# Altium project LimeSDR-PCIe_1v3.PrjPcb (part 5 of 7)

## Sheet 14_Clocks_1.SchDoc: Clocks 1
size A3; Organization: Lime Microsystems; Address1: Surrey Tech Centre; Address2: Guildford GU2 7YG; Address3: Surrey; Address4: United Kingdom; Revision: v1.3; SheetNumber: 14; SheetTotal: 16
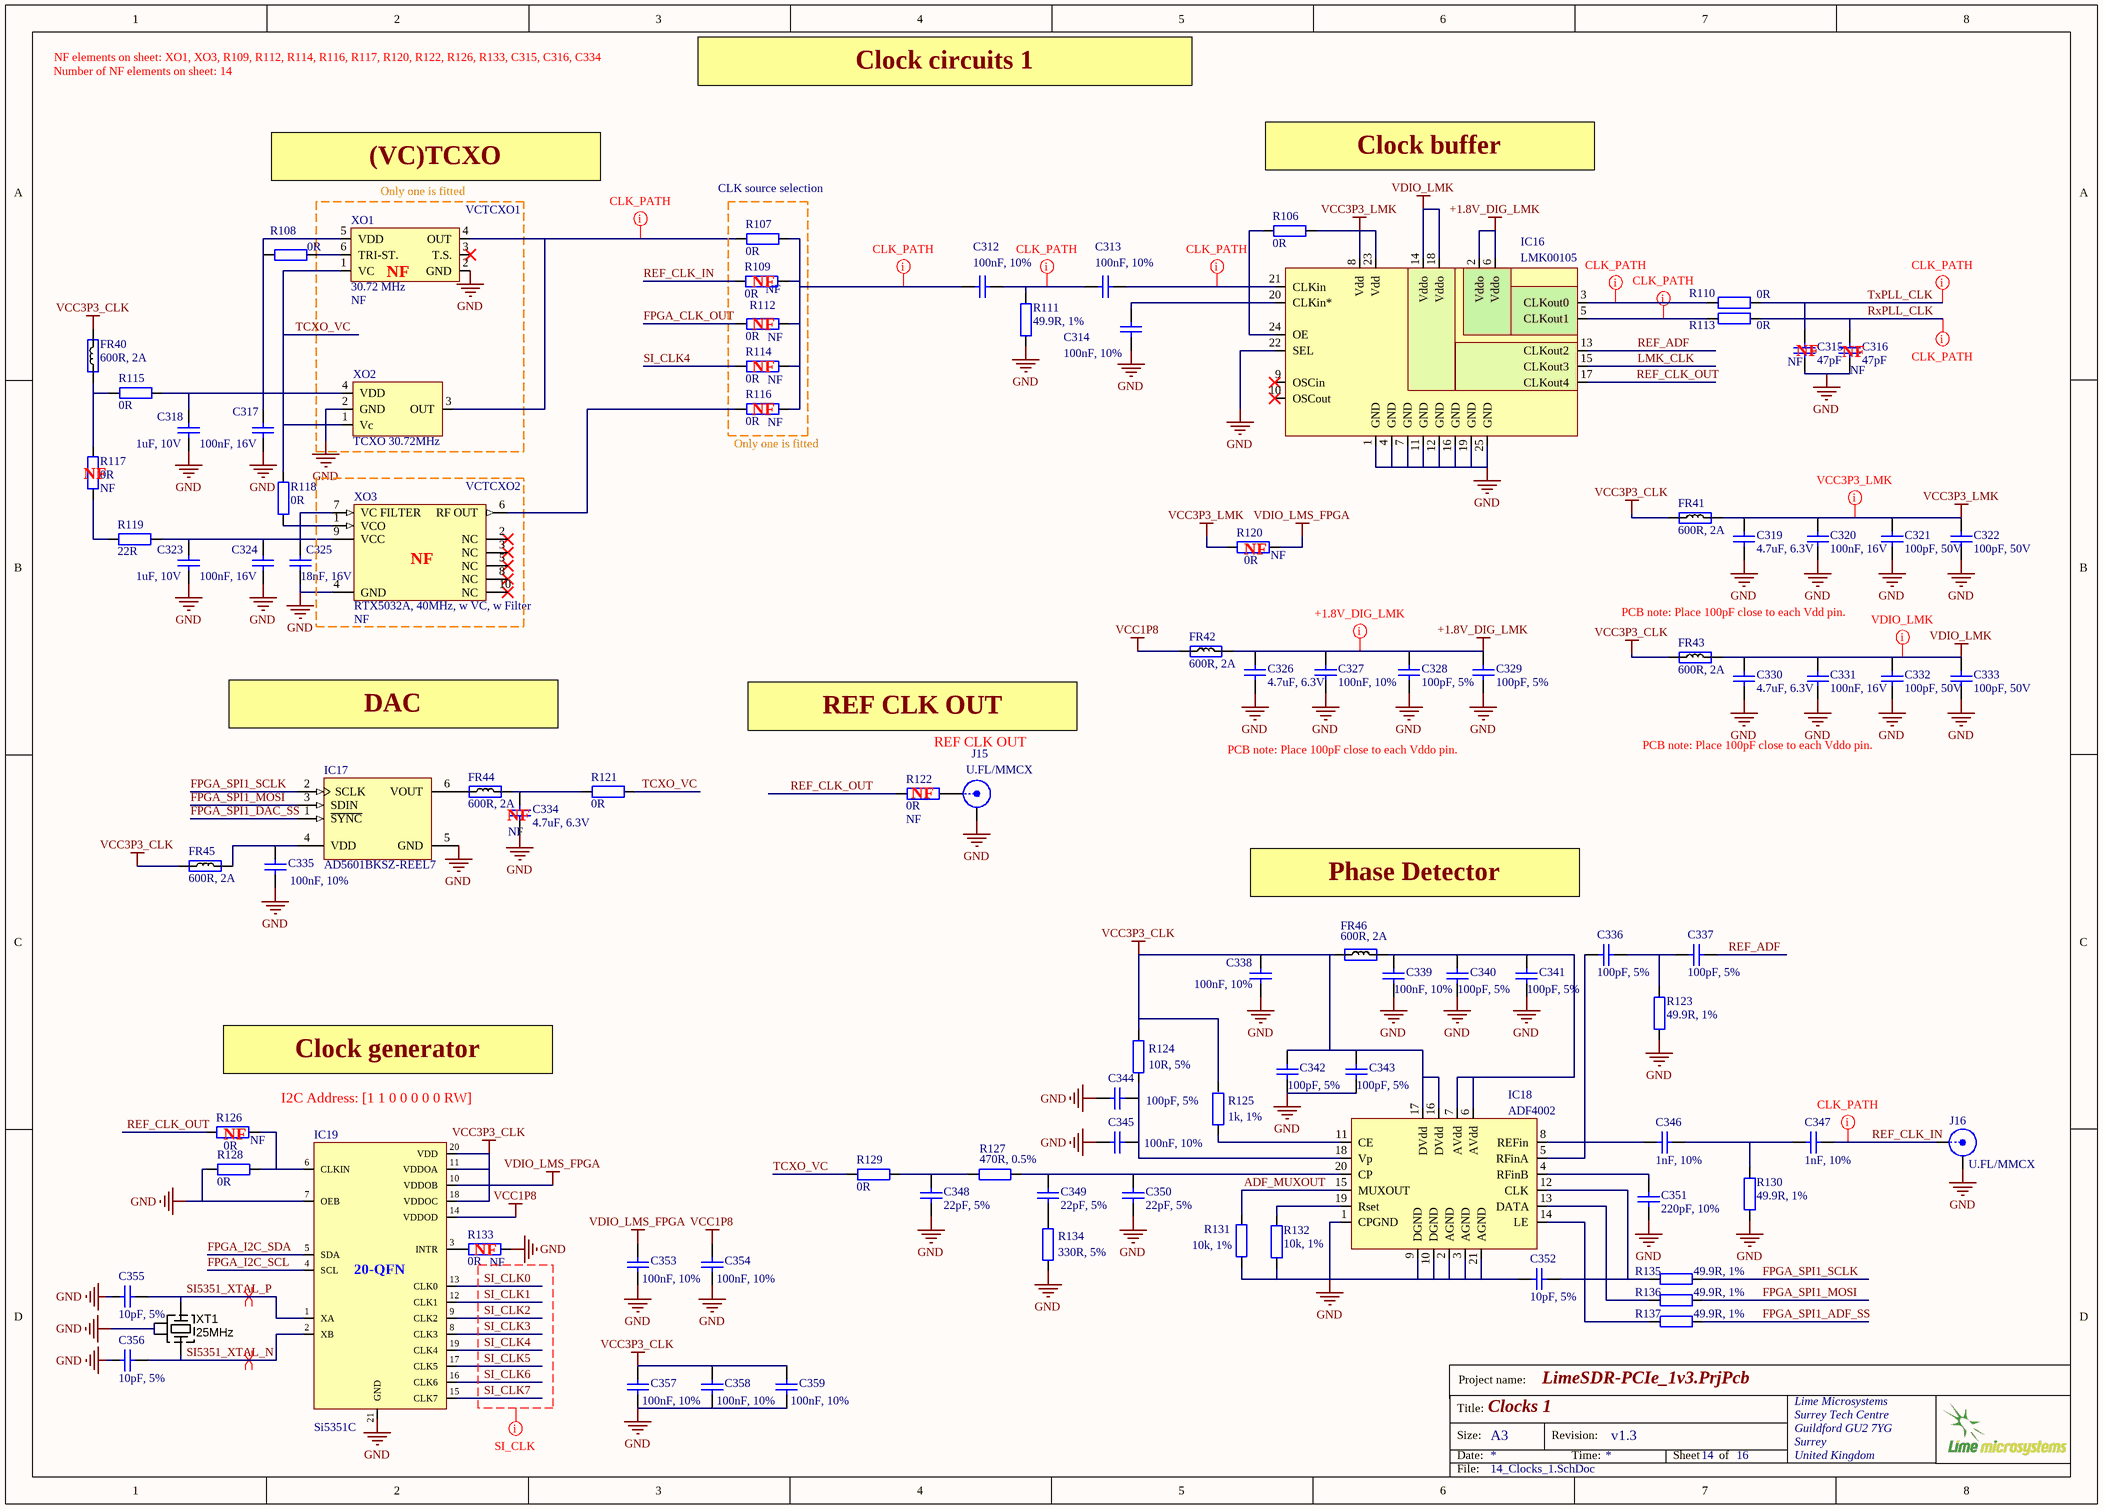
[diagram p14: 14_Clocks_1.SchDoc]

### Parts
C312  100nF, 10%  [CAP0402]
C313  100nF, 10%  [CAP0402]
C314  100nF, 10%  [CAP0402]
C315  47pF  Assembly Info: NF  [CAP0402]
C316  47pF  Assembly Info: NF  [CAP0402]
C317  100nF, 16V  [CAP0402]
C318  1uF, 10V  [CAP0402]
C319  4.7uF, 6.3V  [CAP0402]
C320  100nF, 16V  [CAP0402]
C321  100pF, 50V  [CAP0402]
C322  100pF, 50V  [CAP0402]
C323  1uF, 10V  [CAP0402]
C324  100nF, 16V  [CAP0402]
C325  18nF, 16V  [CAP0402]
C326  4.7uF, 6.3V  [CAP0402]
C327  100nF, 10%  [CAP0402]
C328  100pF, 5%  [CAP0402]
C329  100pF, 5%  [CAP0402]
C330  4.7uF, 6.3V  [CAP0402]
C331  100nF, 16V  [CAP0402]
C332  100pF, 50V  [CAP0402]
C333  100pF, 50V  [CAP0402]
C334  4.7uF, 6.3V  Assembly Info: NF  [CAP0402]
C335  100nF, 10%  [CAP0402]
C336  100pF, 5%  [CAP0402]
C337  100pF, 5%  [CAP0402]
C338  100nF, 10%  [CAP0402]
C339  100nF, 10%  [CAP0402]
C340  100pF, 5%  [CAP0402]
C341  100pF, 5%  [CAP0402]
C342  100pF, 5%  [CAP0402]
C343  100pF, 5%  [CAP0402]
C344  100pF, 5%  [CAP0402]
C345  100nF, 10%  [CAP0402]
C346  1nF, 10%  [CAP0402]
C347  1nF, 10%  [CAP0402]
C348  22pF, 5%  [CAP0402]
C349  22pF, 5%  [CAP0402]
C350  22pF, 5%  [CAP0402]
C351  220pF, 10%  [CAP0402]
C352  10pF, 5%  [CAP0402]
C353  100nF, 10%  [CAP0402]
C354  100nF, 10%  [CAP0402]
C355  10pF, 5%  [CAP0402]
C356  10pF, 5%  [CAP0402]
C357  100nF, 10%  [CAP0402]
C358  100nF, 10%  [CAP0402]
C359  100nF, 10%  [CAP0402]
FR40  600R, 2A  [RES0805]
FR41  600R, 2A  [RES0805]
FR42  600R, 2A  [RES0805]
FR43  600R, 2A  [RES0805]
FR44  600R, 2A  [RES0805]
FR45  600R, 2A  [RES0805]
FR46  600R, 2A  [RES0805]
IC16  LMK00105  [LMK00105SQ]
IC17  AD5601BKSZ-REEL7  [AD5601_SOT23-6]
IC18  ADF4002  [ADF4002]
IC19  Si5351C  [Si5351C_20QFN]
J15  U.FL/MMCX  [MMCX_UFL_conn_u]
J16  U.FL/MMCX  [MMCX_UFL_conn_u]
R106  0R  [RES0402]
R107  0R  [RES0402_v2]
R108  0R  [RES0402]
R109  0R  Assembly Info: NF  [RES0402_v2]
R110  0R  [RES0402]
R111  49.9R, 1%  [RES0402]
R112  0R  Assembly Info: NF  [RES0402_v2]
R113  0R  [RES0402]
R114  0R  Assembly Info: NF  [RES0402_v2]
R115  0R  [RES0402]
R116  0R  Assembly Info: NF  [RES0402_v2]
R117  0R  Assembly Info: NF  [RES0402]
R118  0R  [RES0402]
R119  22R  [RES0402]
R120  0R  Assembly Info: NF  [RES0402]
R121  0R  [RES0402]
R122  0R  Assembly Info: NF  [RES0402]
R123  49.9R, 1%  [RES0402]
R124  10R, 5%  [RES0402]
R125  1k, 1%  [RES0402]
R126  0R  Assembly Info: NF  [RES0402]
R127  470R, 0.5%  [RES0402]
R128  0R  [RES0402]
R129  0R  [RES0402]
R130  49.9R, 1%  [RES0402]
R131  10k, 1%  [RES0402]
R132  10k, 1%  [RES0402]
R133  0R  Assembly Info: NF  [RES0402]
R134  330R, 5%  [RES0402]
R135  49.9R, 1%  [RES0402]
R136  49.9R, 1%  [RES0402]
R137  49.9R, 1%  [RES0402]
XO1  30.72 MHz  Assembly Info: NF  [RAKON_RPT7050A]
XO2  TCXO 30.72MHz  [RAKON_TXCO]
XO3  RTX5032A, 40MHz, w VC, w Filter  Assembly Info: NF  [RAKON_RTX5032A]
XT1  25MHz  [CRYSTAL_4-LCC]

### Blocks framed on the sheet
VCTCXO2: XO3

### Nets
+1.8V_DIG_LMK: C326.2 C327.2 C328.2 C329.2 FR42.2 IC16.2(Vddo) IC16.6(Vddo)
GND: C314.1 C315.1 C316.1 C317.1 C318.1 C319.1 C320.1 C321.1 C322.1 C323.1 C324.1 C325.1 C326.1 C327.1 C328.1 C329.1 C330.1 C331.1 C332.1 C333.1 C334.1 C335.2 C338.1 C339.1 C340.2 C341.2 C342.2 C343.2 C344.1 C345.2 C348.1 C350.1 C351.2 C352.1 C353.2 C354.2 C355.1 C356.1 C357.2 C358.2 C359.2 IC16.1(GND) IC16.4(GND) IC16.7(GND) IC16.11(GND) IC16.12(GND) IC16.16(GND) IC16.19(GND) IC16.22(SEL) IC16.25(GND) IC17.5(GND) IC18.1(CPGND) IC18.2(AGND) IC18.3(AGND) IC18.9(DGND) IC18.10(DGND) IC18.21(AGND) IC19.7(OEB) IC19.21(GND) J15.2(Y) J16.2(Y) R111.1 R123.1 R128.2 R130.1 R131.2 R132.2 R133.1 R134.1 XO1.2(GND) XO2.2(GND) XO3.4(GND) XT1.2(GND) XT1.4(GND)
VCC1P8: C354.1 FR42.1 IC19.14(VDDOD)
VCC3P3_CLK: C338.2 C342.1 C343.1 C357.1 C358.1 C359.1 FR40.1 FR41.1 FR43.1 FR45.1 FR46.1 IC18.16(DVdd) IC18.17(DVdd) IC19.11(VDDOA) IC19.18(VDDOC) IC19.20(VDD) R124.2 R125.2
VCC3P3_LMK: C319.2 C320.2 C321.2 C322.2 FR41.2 IC16.8(Vdd) IC16.23(Vdd) R106.2 R120.1
VDIO_LMK: C330.2 C331.2 C332.2 C333.2 FR43.2 IC16.14(Vddo) IC16.18(Vddo)
VDIO_LMS_FPGA: C353.1 IC19.10(VDDOB) R120.2
ADF_MUXOUT: IC18.15(MUXOUT) R131.1
FPGA_CLK_OUT: R112.2
FPGA_I2C_SCL: IC19.4(SCL)
FPGA_I2C_SDA: IC19.5(SDA)
FPGA_SPI1_ADF_SS: R137.1
FPGA_SPI1_DAC_SS: IC17.1(~{SYNC})
FPGA_SPI1_MOSI: IC17.3(SDIN) R136.1
FPGA_SPI1_SCLK: IC17.2(SCLK) R135.1
LMK_CLK: IC16.15(CLKout3)
REF_ADF: C337.2 IC16.13(CLKout2)
REF_CLK_IN: C347.1 J16.1(X) R109.1
REF_CLK_OUT: IC16.17(CLKout4) R122.2 R126.1
RxPLL_CLK: C316.2 R113.1
SI5351_XTAL_N: C356.2 IC19.2(XB) XT1.3(X)
SI5351_XTAL_P: C355.2 IC19.1(XA) XT1.1(X)
SI_CLK0: IC19.13(CLK0)
SI_CLK1: IC19.12(CLK1)
SI_CLK2: IC19.9(CLK2)
SI_CLK3: IC19.8(CLK3)
SI_CLK4: IC19.19(CLK4) R114.2
SI_CLK5: IC19.17(CLK5)
SI_CLK6: IC19.16(CLK6)
SI_CLK7: IC19.15(CLK7)
TCXO_VC: R118.1 R121.1 R129.2 XO1.1(VC) XO2.1(Vc)
TxPLL_CLK: C315.2 R110.1
NetC312_1: C312.1 C313.2 R111.2
NetC312_2: C312.2 R107.1 R109.2 R112.1 R114.1 R116.1
NetC313_1: C313.1 IC16.21(CLKin)
NetC314_2: C314.2 IC16.20(CLKin*)
NetC317_2: C317.2 C318.2 R108.2 R115.1 XO1.5(VDD) XO2.4(VDD)
NetC323_2: C323.2 C324.2 R119.2 XO3.9(VCC)
NetC325_2: C325.2 XO3.7(VC_FILTER)
NetC334_2: C334.2 FR44.2 R121.2
NetC335_1: C335.1 FR45.2 IC17.4(VDD)
NetC336_1: C336.1 IC18.5(RFinA)
NetC336_2: C336.2 C337.1 R123.2
NetC339_2: C339.2 C340.1 C341.1 FR46.2 IC18.6(AVdd) IC18.7(AVdd)
NetC344_2: C344.2 C345.1 IC18.18(Vp) R124.1
NetC346_1: C346.1 C347.2 R130.2
NetC346_2: C346.2 IC18.8(REFin)
NetC348_2: C348.2 R127.2 R129.1
NetC349_1: C349.1 R134.2
NetC349_2: C349.2 C350.2 IC18.20(CP) R127.1
NetC351_1: C351.1 IC18.4(RFinB)
NetC352_2: C352.2 IC18.12(CLK) R135.2
NetFR40_2: FR40.2 R115.2 R117.1
NetFR44_1: FR44.1 IC17.6(VOUT)
NetIC16_3: IC16.3(CLKout0) R110.2
NetIC16_5: IC16.5(CLKout1) R113.2
NetIC16_24: IC16.24(OE) R106.1
NetIC18_11: IC18.11(CE) R125.1
NetIC18_13: IC18.13(DATA) R136.2
NetIC18_14: IC18.14(LE) R137.2
NetIC18_19: IC18.19(Rset) R132.1
NetIC19_3: IC19.3(INTR) R133.2
NetIC19_6: IC19.6(CLKIN) R126.2 R128.1
NetJ15_1: J15.1(X) R122.1
NetR107_2: R107.2 XO1.4(OUT) XO2.3(OUT)
NetR108_1: R108.1 XO1.6(TRI-ST.)
NetR116_2: R116.2 XO3.6(RF_OUT)
NetR117_2: R117.2 R119.1
NetR118_2: R118.2 XO3.1(VCO)

Not connected (* = marked no-connect by the designer): IC16 9(OSCin)* 10(OSCout)*; XO1 3(T.S.)*; XO3 2(NC)* 3(NC)* 5(NC)* 8(NC)* 10(NC)*

### Layout directives
net class CLK_PATH: NetC312_1, NetC312_2, NetC313_1, NetIC16_3, NetIC16_5, NetR107_2, REF_CLK_IN, RxPLL_CLK, TxPLL_CLK
net class SI_CLK: SI_CLK0, SI_CLK1, SI_CLK2, SI_CLK3, SI_CLK4, SI_CLK5, SI_CLK6, SI_CLK7
differential pair: SI5351_XTAL_N, SI5351_XTAL_P
net class +1.8V_DIG_LMK: +1.8V_DIG_LMK
net class VCC3P3_LMK: VCC3P3_LMK
net class VDIO_LMK: VDIO_LMK

### Notes on the sheet
- Number of NF elements on sheet: 14
- NF elements on sheet: XO1, XO3, R109, R112, R114, R116, R117, R120, R122, R126, R133, C315, C316, C334
- Clock circuits 1
- (VC)TCXO
- Clock buffer
- (near XO1) Only one is fitted
- (near XO1) VCTCXO1
- (near R107) CLK source selection
- (near XO1) NF
- (near R109) NF
- (near R112) NF
- (near R114) NF
- (near C315) NF
- (near C316) NF
- (near R116) Only one is fitted
- (near R116) NF
- (near R117) NF
- (near XO3) NF
- (near R120) NF
- PCB note: Place 100pF close to each Vdd pin.
- DAC
- REF CLK OUT
- PCB note: Place 100pF close to each Vddo pin.
- (near C334) NF
- (near R122) NF
- Phase Detector
- Clock generator
- I2C Address: [1 1 0 0 0 0 0 RW]
- (near R126) NF
- (near R133) NF
- Project name:
- Title:
- Size:
- Date:
- A3
- Revision:
- Time:
- Sheet
- of
- File:
- (in symbol Si5351C) 20-QFN

### Library data of the parts
C312-C314 C327 C338 C339 C345 = Cap_0402: Manufacturer: Murata Electronics; Manufacturer Part Number: GRM155R71C104KA88D; Part Description: 0.10µF ±10% 16V X7R Ceramic Capacitor -55°C ~ 125°C Surface Mount, MLCC 0402 (1005 Metric) 0.039" L x 0.020" W (1.00mm x 0.50mm); Voltage Rating DC: 16 V; Type: General Purpose MLCC; Capacitance: 0.1 uF; Case Length: 1 mm; Dielectric: X7R; Case Height: 0.5 mm; Temperature Coefficient / Code: +/- 15 %; Value: 100nF, 10%; Supplier 1: Mouser; Supplier Part Number 1: 81-GRM155R71C104KA88; Case Code - in: 0402; RoHS: RoHS Compliant; Operating Temperature Range: - 55 C to + 125 C; Series: GRM; Termination Style: SMD/SMT; Tolerance: 10 %; Package / Case: 0402 (1005 metric); Maximum Operating Temperature: + 125 C; Case Code - mm: 1005; Minimum Operating Temperature: - 55 C; Product Category: Low & Medium Capacitance SMD Ceramic Chip Capacitors; Packaging: Reel; Product: General Type MLCCs; Category: Multilayer Ceramic Capacitors MLCC - SMD/SMT; Brand: Murata Electronics; Case Width: 0.5 mm; RoHS - Mouser: Y; Standard Pack Qty: 10000; Minimum Order Quantity: 1; Reeling: True; Manufacturer Part Number 1: GRM155R71C104KA88D
C315 C316 = Cap_0402: Manufacturer Part Number 1: C1005C0G1H470F050BA; Manufacturer: TDK Corporation; Part Description: 47pF ±1% 50V C0G, NP0 Ceramic Capacitor -55°C ~ 125°C Surface Mount, MLCC 0402 (1005 Metric) 0.039" L x 0.020" W (1.00mm x 0.50mm); Voltage - Rated: 50V; Temperature Coefficient: C0G, NP0; Tolerance: ±1%; Value: 47pF; Supplier 1: Digi-Key; Supplier Part Number 1: 445-5361-1-ND; Package / Case: 0402 (1005 Metric); Lead Spacing: -; Ratings: -; Mounting Type: Surface Mount, MLCC; Operating Temperature: -55°C ~ 125°C; Thickness (Max): 0.022" (0.55mm); Capacitance: 47pF; Packaging: Cut Tape (CT); Features: -; Applications: General Purpose; Lead Style: -; Size / Dimension: 0.039" L x 0.020" W (1.00mm x 0.50mm); Height - Seated (Max): -; RoHS: RoHS Compliant; Category: Capacitors
C317 C320 C324 C331 = Cap_0402: Manufacturer: Murata Electronics; Manufacturer Part Number: GRM155R71C104KA88D; Part Description: 0.10µF ±10% 16V X7R Ceramic Capacitor -55°C ~ 125°C Surface Mount, MLCC 0402 (1005 Metric) 0.039" L x 0.020" W (1.00mm x 0.50mm); Tolerance: 10 %; Type: General Purpose MLCC; Capacitance: 0.1 uF; Case Length: 1 mm; Dielectric: X7R; Case Height: 0.5 mm; Temperature Coefficient / Code: +/- 15 %; Value: 100nF, 16V; Supplier 1: Mouser; Supplier Part Number 1: 81-GRM155R71C104KA88; Case Code - in: 0402; RoHS: RoHS Compliant; Operating Temperature Range: - 55 C to + 125 C; Series: GRM; Termination Style: SMD/SMT; Package / Case: 0402 (1005 metric); Voltage Rating DC: 16 V; Maximum Operating Temperature: + 125 C; Case Code - mm: 1005; Minimum Operating Temperature: - 55 C; Product Category: Low & Medium Capacitance SMD Ceramic Chip Capacitors; Packaging: Reel; Product: General Type MLCCs; Category: Multilayer Ceramic Capacitors MLCC - SMD/SMT; Brand: Murata Electronics; Case Width: 0.5 mm; RoHS - Mouser: Y; Standard Pack Qty: 10000; Minimum Order Quantity: 1; Reeling: True; Manufacturer Part Number 1: GRM155R71C104KA88D
C318 C323 = Cap_0402: Manufacturer Part Number 1: GRM155R61A105KE15J; Manufacturer: TDK; Part Description: 1µF ±10% 10V X5R Ceramic Capacitor -55°C ~ 85°C Surface Mount, MLCC 0402 (1005 Metric) 0.039" L x 0.020" W (1.00mm x 0.50mm); Voltage Rating: 10; Capacitance Tolerance: ± 10%; Product Range: TDK - C Series; Ceramic Capacitor Case: 0402 [1005 Metric]; Capacitance: 1; Dielectric Characteristic: X6; Value: 1uF, 10V; Supplier 1: Newark; Supplier Part Number 1: 490-6298-2-ND; MSL: -; RoHS: YES
C319 C326 C330 C334 = Cap_0402: Manufacturer Part Number 1: GRM155R60J475ME87D; Manufacturer: Murata Electronics North America; Part Description: 4.7µF ±20% 6.3V X5R Ceramic Capacitor -55°C ~ 85°C Surface Mount, MLCC 0402 (1005 Metric) 0.039" L x 0.020" W (1.00mm x 0.50mm); Temperature Coefficient: X5R; Capacitance: 4.7µF; Tolerance: ±20%; Value: 4.7uF, 6.3V; Supplier 1: Digi-Key; Supplier Part Number 1: 490-5408-1-ND; Category: Capacitors; Voltage - Rated: 6.3V; Thickness (Max): 0.022" (0.55mm); Applications: General Purpose; Package / Case: 0402 (1005 Metric); Size / Dimension: 0.039" L x 0.020" W (1.00mm x 0.50mm); Features: Derating Recommended; Mounting Type: Surface Mount, MLCC; Ratings: -; Lead Style: -; Operating Temperature: -55°C ~ 85°C; Lead Spacing: -; RoHS: RoHS Compliant; Height - Seated (Max): -; Packaging: Cut Tape (CT)
C321 C322 C332 C333 = Cap_0402: Manufacturer Part Number 1: CC0402JRNPO9BN101; Manufacturer: Yageo; Part Description: 100pF ±5% 50V C0G, NP0 Ceramic Capacitor -55°C ~ 125°C Surface Mount, MLCC 0402 (1005 Metric) 0.039" L x 0.020" W (1.00mm x 0.50mm); Temperature Coefficient: C0G, NP0; Tolerance: ±5%; Value: 100pF, 50V; Supplier 1: Digi-Key; Supplier Part Number 1: 311-1024-1-ND; RoHS: RoHS Compliant; Category: Capacitors; Applications: General Purpose; Mounting Type: Surface Mount, MLCC; Capacitance: 100pF; Ratings: -; Packaging: Cut Tape (CT); Voltage - Rated: 50V; Size / Dimension: 0.039" L x 0.020" W (1.00mm x 0.50mm); Height - Seated (Max): -; Package / Case: 0402 (1005 Metric); Operating Temperature: -55°C ~ 125°C; Features: -; Lead Spacing: -; Lead Style: -; Thickness (Max): 0.022" (0.55mm)
C325 = Cap_0402: Manufacturer: Yageo; Manufacturer Part Number 1: CC0402KRX7R7BB183; Part Description: CAP CER 0.018UF 16V X7R 0402; Temperature Coefficient: X7R; Capacitance: 0.018µF; Tolerance: ±10%; Value: 18nF, 16V; Supplier 1: Digi-Key; Supplier Part Number 1: 311-1706-1-ND; Part Status: Active; Category: Capacitors; Packaging: Cut Tape (CT); Voltage - Rated: 16V; RoHS: RoHS Compliant; Size / Dimension: 0.039" L x 0.020" W (1.00mm x 0.50mm); Package / Case: 0402 (1005 Metric); Mounting Type: Surface Mount, MLCC; Thickness (Max): 0.022" (0.55mm); Applications: General Purpose; Operating Temperature: -55°C ~ 125°C
C328 C329 = Cap_0402: Manufacturer Part Number 1: CC0402JRNPO9BN101; Manufacturer: Yageo; Part Description: 100pF ±5% 50V C0G, NP0 Ceramic Capacitor -55°C ~ 125°C Surface Mount, MLCC 0402 (1005 Metric) 0.039" L x 0.020" W (1.00mm x 0.50mm); Voltage - Rated: 50V; Temperature Coefficient: C0G, NP0; Value: 100pF, 5%; Supplier 1: Digi-Key; Supplier Part Number 1: 311-1024-1-ND; RoHS: RoHS Compliant; Category: Capacitors; Applications: General Purpose; Mounting Type: Surface Mount, MLCC; Capacitance: 100pF; Ratings: -; Packaging: Cut Tape (CT); Size / Dimension: 0.039" L x 0.020" W (1.00mm x 0.50mm); Height - Seated (Max): -; Package / Case: 0402 (1005 Metric); Operating Temperature: -55°C ~ 125°C; Features: -; Tolerance: ±5%; Lead Spacing: -; Lead Style: -; Thickness (Max): 0.022" (0.55mm)
C335 C353 C354 C357-C359 = Cap_0603: Manufacturer Part Number 1: GRM155R71C104KA88D; Part Description: 0.10µF ±10% 16V X7R Ceramic Capacitor -55°C ~ 125°C Surface Mount, MLCC 0402 (1005 Metric) 0.039" L x 0.020" W (1.00mm x 0.50mm); Brand: Murata Electronics; Type: General Purpose MLCC; Capacitance: 0.1 uF; Temperature Coefficient / Code: +/- 15 %; Voltage Rating DC: 16 V; Supplier 1: Mouser; Supplier Part Number 1: 81-GRM155R71C104KA88; Tolerance: 10 %; Case Code - in: 0402; Manufacturer: Murata Electronics; Category: Multilayer Ceramic Capacitors MLCC - SMD/SMT; Value: 100nF, 10%; Manufacturer Part Number: GRM155R71C104KA88D; Maximum Operating Temperature: + 125 C; Minimum Operating Temperature: - 55 C; Minimum Order Quantity: 1; Operating Temperature Range: - 55 C to + 125 C; Package / Case: 0402 (1005 metric); Packaging: Reel; Product: General Type MLCCs; Product Category: Low & Medium Capacitance SMD Ceramic Chip Capacitors; Reeling: True; RoHS - Mouser: Y; RoHS: RoHS Compliant; Series: GRM; Standard Pack Qty: 10000; Termination Style: SMD/SMT
C336 C337 C340-C344 = Cap_0402: Manufacturer: Yageo; Manufacturer Part Number 1: CC0402JRNPO9BN101; Part Description: 100pF ±5% 50V C0G, NP0 Ceramic Capacitor -55°C ~ 125°C Surface Mount, MLCC 0402 (1005 Metric) 0.039" L x 0.020" W (1.00mm x 0.50mm); Voltage - Rated: 50V; Temperature Coefficient: C0G, NP0; Value: 100pF, 5%; Supplier 1: Digi-Key; Supplier Part Number 1: 311-1024-1-ND; Category: Capacitors; Features: -; Operating Temperature: -55°C ~ 125°C; Capacitance: 100pF; Thickness (Max): 0.022" (0.55mm); RoHS: RoHS Compliant; Lead Style: -; Ratings: -; Size / Dimension: 0.039" L x 0.020" W (1.00mm x 0.50mm); Height - Seated (Max): -; Applications: General Purpose; Package / Case: 0402 (1005 Metric); Lead Spacing: -; Packaging: Tape & Reel (TR); Mounting Type: Surface Mount, MLCC; Tolerance: ±5%
C346 C347 = Cap_0402: Manufacturer Part Number 1: GCM155R71H102KA37D; Part Description: 1000pF ±10% 50V X7R Ceramic Capacitor -55°C ~ 125°C Surface Mount, MLCC 0402 (1005 Metric) 0.039" L x 0.020" W (1.00mm x 0.50mm); Capacitance: 1000 pF; Type: Automotive Ultra Small MLCC; Brand: Murata Electronics; Case Height: 0.5 mm; Case Length: 1 mm; Dielectric: X7R; Voltage Rating DC: 50 V; Temperature Coefficient / Code: +/- 15 %; Value: 1nF, 10%; Supplier 1: Mouser; Supplier Part Number 1: 81-GCM155R71H102KA7D; Case Code - in: 0402; Package / Case: 0402 (1005 metric); Tolerance: 10 %; Termination Style: SMD/SMT; Packaging: Reel; Operating Temperature Range: - 55 C to + 125 C; Maximum Operating Temperature: + 125 C; Manufacturer: Murata Electronics; Category: Multilayer Ceramic Capacitors MLCC - SMD/SMT; RoHS: RoHS Compliant; Series: GCM; Case Width: 0.5 mm; Case Code - mm: 1005; Product: Automotive MLCCs; Standard Pack Qty: 10000; Reeling: True; RoHS - Mouser: Y; Minimum Order Quantity: 1; Product Category: Automotive Ceramic Chip Capacitors; Minimum Operating Temperature: - 55 C
C348-C350 = Cap_0402: Manufacturer: Yageo; Manufacturer Part Number 1: CC0402JRNPO9BN220; Part Description: 22pF ±5% 50V C0G, NP0 Ceramic Capacitor -55°C ~ 125°C Surface Mount, MLCC 0402 (1005 Metric) 0.039" L x 0.020" W (1.00mm x 0.50mm); Voltage - Rated: 50V; Temperature Coefficient: C0G, NP0; Value: 22pF, 5%; Supplier 1: Digi-Key; Supplier Part Number 1: 311-1018-2-ND; Tolerance: ±5%; Category: Capacitors; Packaging: Tape & Reel (TR); RoHS: RoHS Compliant; Capacitance: 22pF; Operating Temperature: -55°C ~ 125°C; Mounting Type: Surface Mount, MLCC; Height - Seated (Max): -; Size / Dimension: 0.039" L x 0.020" W (1.00mm x 0.50mm); Ratings: -; Applications: General Purpose; Thickness (Max): 0.022" (0.55mm); Lead Spacing: -; Lead Style: -; Features: -; Package / Case: 0402 (1005 Metric)
C351 = Cap_0402: Manufacturer Part Number 1: CC0402KRX7R9BB221; Manufacturer: Yageo; Part Description: 220pF ±10% 50V X7R Ceramic Capacitor -55°C ~ 125°C Surface Mount, MLCC 0402 (1005 Metric) 0.039" L x 0.020" W (1.00mm x 0.50mm); Temperature Coefficient: X7R; Voltage - Rated: 50V; Value: 220pF, 10%; Supplier 1: Digi-Key; Supplier Part Number 1: 311-1035-2-ND; Category: Capacitors; Ratings: -; RoHS: RoHS Compliant; Packaging: Tape & Reel (TR); Mounting Type: Surface Mount, MLCC; Applications: General Purpose; Capacitance: 220pF; Tolerance: ±10%; Operating Temperature: -55°C ~ 125°C; Package / Case: 0402 (1005 Metric); Lead Spacing: -; Size / Dimension: 0.039" L x 0.020" W (1.00mm x 0.50mm); Thickness (Max): 0.022" (0.55mm); Height - Seated (Max): -; Lead Style: -; Features: -
C352 = Cap_0402: Manufacturer Part Number 1: 04023A100JAT2A; Manufacturer: AVX; Part Description: 10pF ±5% 25V C0G, NP0 Ceramic Capacitor -55°C ~ 125°C Surface Mount, MLCC 0402 (1005 Metric) 0.039" L x 0.020" W (1.00mm x 0.50mm); Voltage Rating: 25; Ceramic Capacitor Case: 0402 [1005 Metric]; Capacitor Case Style: 0402 [1005 Metric]<!--FANDB--><div class="features-and-benefits-container"></div>; Dielectric Characteristic: C0G / NP0; SVHC: No SVHC (16-Jun-2014); Capacitance: 10; Value: 10pF, 5%; Supplier 1: Farnell; Supplier Part Number 1: 2332478RL; Capacitance Tolerance: ± 5%; Product Range: -; RoHS: YES; Operating Temperature Min: -55; Operating Temperature Max: 125; Capacitance Tolerance ±: ± 5%; MSL: MSL 1 - Unlimited; Packaging: Cut Tape
C355 C356 = Cap_0402: Manufacturer: AVX; Manufacturer Part Number 1: 04023A100JAT2A; Part Description: 10pF ±5% 25V C0G, NP0 Ceramic Capacitor -55°C ~ 125°C Surface Mount, MLCC 0402 (1005 Metric) 0.039" L x 0.020" W (1.00mm x 0.50mm); Capacitance: 10; Ceramic Capacitor Case: 0402 [1005 Metric]; Capacitor Case Style: 0402 [1005 Metric]<!--FANDB--><div class="features-and-benefits-container"></div>; Dielectric Characteristic: C0G / NP0; SVHC: No SVHC (16-Jun-2014); Voltage Rating: 25; Supplier 1: Farnell; Supplier Part Number 1: 2332478RL; Capacitance Tolerance: ± 5%; value: 10pF, 5%; Capacitance Tolerance ±: ± 5%; MSL: MSL 1 - Unlimited; Operating Temperature Max: 125; Operating Temperature Min: -55; Packaging: Cut Tape; Product Range: -; RoHS: YES
FR40 = Ferrite: Manufacturer Part Number 1: MPZ2012S601AT000; Manufacturer: TDK Corporation; Part Description: FERRITE BEAD 600 OHM 0805 1LN; DC Resistance (DCR): 100 mOhm Max; Filter Type: Differential Mode - Single; Impedance @ Frequency: 600 Ohm @ 100MHz; Supplier 1: Digi-Key; Supplier Part Number 1: 445-2206-2-ND; Value: 600R, 2A; Category: Filters; Current Rating: 2A; Height (Max): 0.041" (1.05mm); Mounting Type: Surface Mount; Package / Case: 0805 (2012 Metric); Packaging: Tape & Reel (TR); RoHS: RoHS Compliant; Size / Dimension: 0.079" L x 0.049" W (2.00mm x 1.25mm)
FR41-FR46 = Ferrite: Manufacturer Part Number 1: MPZ2012S601AT000; Manufacturer: TDK Corporation; Part Description: FERRITE BEAD 600 OHM 0805 1LN; Filter Type: Differential Mode - Single; Impedance @ Frequency: 600 Ohm @ 100MHz; DC Resistance (DCR): 100 mOhm Max; Supplier 1: Digi-Key; Supplier Part Number 1: 445-2206-2-ND; Mounting Type: Surface Mount; RoHS: RoHS Compliant; Height (Max): 0.041" (1.05mm); Packaging: Tape & Reel (TR); Category: Filters; Current Rating: 2A; Package / Case: 0805 (2012 Metric); Size / Dimension: 0.079" L x 0.049" W (2.00mm x 1.25mm)
IC16 = LMK00105: Manufacturer: Texas Instruments; Manufacturer Part Number 1: LMK00105SQ/NOPB; Part Description: IC CLK BUFFER 2:5 200MHZ 24WQFN; Frequency - Max: 200MHz; Voltage - Supply: 2.375 V ~ 3.45 V; Input: HCSL, LVCMOS, LVDS, LVPECL, LVTTL, SSTL, Crystal; Differential - Input:Output: Yes/No; Supplier 1: Digi-Key; Type: Fanout Buffer (Distribution), Multiplexer, Translator; Category: Integrated Circuits (ICs); Operating Temperature: -40°C ~ 85°C; Package / Case: 24-WFQFN Exposed Pad; Supplier Device Package: 24-WQFN (4x4); Supplier Part Number 1: LMK00105SQ/NOPBCT-ND
IC17 = AD5601BKSZ-REEL7: Single 8-Bit nanoDAC with SPI Interface in LFCSP and SC70, 2.7 to 5.5 V, <100 uA, -40 to +125 degC, KS-6, Pb-Free, Reel; Generic Part Number: AD5601; Manufacturer: Analog Devices; Part Description: IC DAC 8BIT BUFF V-OUT SC70-6; # DAC Outputs: 1; Max V+: 5.5V; Op Pwr Diss: 550µW; Resolution (Bits): 8; Settling Time: 6µs; Single Supply: Yes; DatasheetVersion: Rev.F; PackageVersion: 072809-A; PackageReference: KS-6; PackageDescription: 6-Lead Thin Shrink Small Outline Transistor Package [SC70]; Supplier 1: Digi-Key; Supplier Part Number 1: AD5601BKSZ-REEL7TR-ND; Supplier 2: Digi-Key; Supplier Part Number 2: AD5601BKSZ-REEL7CT-ND; Supplier 3: Digi-Key; Supplier Part Number 3: AD5601BKSZ-REEL7DKR-ND; Supplier 4: Farnell; Supplier Part Number 4: 2312971; Supplier 5: Newark; Supplier Part Number 5: 59K4256; Supplier 6: Newark; Supplier Part Number 6: 67W3160; Supplier 7: Mouser; Supplier Part Number 7: 584-AD5601BKSZ-R7; Packing: Reel; RoHS: Y; Mounting Technology: Surface Mount; Code_JEDEC: MO-203-AB; PartNumber: AD5601BKSZ-REEL7; ComponentLink1Description: Manufacturer URL; ComponentLink1URL: http://www.analog.com/en/index.html; ComponentLink2Description: Datasheet; ComponentLink2URL: http://www.analog.com/static/imported-files/data_sheets/AD5601_5611_5621.pdf; ComponentLink3Description: Package Specification; ComponentLink3URL: http://www.analog.com/static/imported-files/packages/PKG_PDF/SC70(KS)/KS_6.pdf; ComponentLink4Description: Product URL; ComponentLink4URL: http://www.analog.com/en/digital-to-analog-converters/da-converters/ad5601/products/product.html
IC18 = ADF4002: Manufacturer: Analog Devices Inc; Manufacturer Part Number 1: ADF4002BCPZ-RL7; Part Description: IC PLL FREQUENCY SYNTH 20-LFCSP; Ratio - Input:Output: 2:1; Differential - Input:Output: Yes/No; Input: CMOS, TTL; Voltage - Supply: 2.7 V ~ 3.3 V; Supplier 1: Digi-Key; Supplier: Digi-Key; Category: Integrated Circuits (ICs); Type: Clock/Frequency Synthesizer (RF), Phase Detector; Operating Temperature: -40°C ~ 85°C; Mounting Type: Surface Mount; Package / Case: 20-VFQFN Exposed Pad, CSP; Supplier Part Number 1: ADF4002BCPZ-RL7CT-ND
IC19 = Si5351C: Manufacturer Part Number 1: SI5351C-B-GM; Manufacturer: Silicon Labs; Part Description: IC CLK GENERATOR 200MHZ 20QFN; PLL: Yes; Input: Clock, Crystal; Output: LVCMOS; Number of Circuits: 1; Ratio - Input:Output: 2:8; Differential - Input:Output: No/No; Frequency - Max: 160MHz; Divider/Multiplier: Yes/No; Voltage - Supply: 1.71 V ~ 3.6 V; Supplier 1: Digi-Key; Supplier Part Number 1: 336-2402-5-ND; Category: Integrated Circuits (ICs); RoHS: RoHS Compliant; Packaging: Tube; Type: Clock Generator; Operating Temperature: -40°C ~ 85°C; Mounting Type: Surface Mount; Package / Case: 20-VFQFN Exposed Pad; Supplier Device Package: 20-QFN (4x4)
J15 J16 = RF_IF_connector: Manufacturer: Molex, LLC; Manufacturer Part Number 1: 0734120110; Part Description: CONN UMC RCPT STR 50 OHM SMD; Shield Termination: Solder; Frequency - Max: 6GHz; Impedance: 50 Ohm; Center Contact Material: Brass; Connector Style: Ultra Miniature Coaxial; Connector Type: Jack, Male Pin; Dielectric Material: Liquid Crystal Polymer (LCP); Center Contact Plating: Gold; Body Finish: Nickel; Body Material: Phosphor Bronze; Voltage Rating: 60V; Supplier 1: Digi-Key; Supplier Part Number 1: WM5587CT-ND; Ingress Protection: -; Category: Connectors, Interconnects; Mounting Type: Surface Mount; Packaging: Cut Tape (CT); Operating Temperature: -40°C ~ 90°C; Housing Color: Silver; Features: -; RoHS: RoHS Compliant; Cable Group: -; Fastening Type: Snap-On; Contact Termination: Solder
R106-R110 R112-R118 R120-R122 R126 R128 R129 R133 = Res_0402: Manufacturer Part Number 1: RC0402JR-070RL; Manufacturer: Yageo; Part Description: RES SMD 0.0OHM JUMPER 1/16W 0402; Resistance (Ohms): 0.0; Tolerance: Jumper; Power (Watts): 0.063W, 1/16W; Value: 0R; Supplier 1: Digi-Key; Supplier Part Number 1: 311-0.0JRTR-ND; Category: Resistors; Temperature Coefficient: -; Features: Moisture Resistant; Supplier Device Package: 0402; Height: 0.016" (0.40mm); Package / Case: 0402 (1005 Metric); Operating Temperature: -55°C ~ 155°C; Size / Dimension: 0.039" L x 0.020" W (1.00mm x 0.50mm); Composition: Thick Film; Packaging: Tape & Reel (TR); Number of Terminations: 2; RoHS: RoHS Compliant
R111 R123 R130 R135-R137 = Res_0402: Manufacturer: Samsung Electro-Mechanics America, Inc.; Manufacturer Part Number: RC1005F49R9CS; Part Description: RES SMD 49.9 OHM 1% 1/16W 0402; Temperature Coefficient: ±100ppm/°C; Resistance (Ohms): 49.9; Power (Watts): 0.063W, 1/16W; Number of Terminations: 2; Size / Dimension: 0.039" L x 0.020" W (1.00mm x 0.50mm); Supplier Device Package: 0402 (1005 Metric); RoHS: RoHS Compliant; Supplier Part Number 1: 1276-3469-6-ND; Features: -; Packaging: Digi-Reel®; Tolerance: ±1%; Height: 0.016" (0.40mm); Category: Resistors; Composition: Thick Film; Package / Case: 0402 (1005 Metric); Supplier 1: Digi-Key; Operating Temperature: -55°C ~ 155°C; Value: 49.9R, 1%
R119 = Res_0402: Part Description: RES SMD 22 OHM 1% 1/16W 0402; Manufacturer Part Number 1: RC0402FR-0722RL; Manufacturer: Yageo; Tolerance: ±1%; Temperature Coefficient: ±100ppm/°C; Resistance (Ohms): 22; Supplier 1: Digi-Key; Supplier Part Number 1: 311-22.0LRTR-ND; Supplier Device Package: 0402; Composition: Thick Film; Category: Resistors; Value: 22R
R124 = Res_0402: Manufacturer Part Number 1: RC0402JR-0710RL; Manufacturer: Yageo; Part Description: RES SMD 10 OHM 5% 1/16W 0402; Power (Watts): 0.063W, 1/16W; Resistance (Ohms): 10; Temperature Coefficient: ±200ppm/°C; Value: 10R, 5%; Supplier 1: Digi-Key; Supplier Part Number 1: 311-10JRTR-ND; Number of Terminations: 2; Height: 0.016" (0.40mm); RoHS: RoHS Compliant; Composition: Thick Film; Packaging: Tape & Reel (TR); Category: Resistors; Supplier Device Package: 0402; Features: Moisture Resistant; Tolerance: ±5%; Operating Temperature: -55°C ~ 155°C; Size / Dimension: 0.039" L x 0.020" W (1.00mm x 0.50mm); Package / Case: 0402 (1005 Metric)
R125 = Res_0402: Manufacturer: Stackpole Electronics Inc; Manufacturer Part Number 1: RMCF0402FT1K00; Part Description: RES SMD 1K OHM 1% 1/16W 0402; Temperature Coefficient: ±100ppm/°C; Power (Watts): 0.063W, 1/16W; Value: 1k, 1%; Supplier 1: Digi-Key; Supplier Part Number 1: RMCF0402FT1K00TR-ND; Resistance (Ohms): 1k; Packaging: Tape & Reel (TR); Category: Resistors; RoHS: RoHS Compliant; Tolerance: ±1%; Height: 0.016" (0.40mm); Number of Terminations: 2; Package / Case: 0402 (1005 Metric); Operating Temperature: -55°C ~ 155°C; Features: -; Composition: Thick Film; Supplier Device Package: 0402; Size / Dimension: 0.039" L x 0.020" W (1.00mm x 0.50mm)
R127 = Res_0402: Manufacturer: Panasonic Electronic Components; Manufacturer Part Number 1: ERA-2AED471X; Part Description: RES SMD 470 OHM 0.5% 1/16W 0402; Power (Watts): 0.063W, 1/16W; Temperature Coefficient: ±25ppm/°C; Resistance (Ohms): 470; Value: 470R, 0.5%; Supplier 1: Digi-Key; Supplier Part Number 1: P470DETR-ND; Tolerance: ±0.5%; Packaging: Tape & Reel (TR); Number of Terminations: 2; Operating Temperature: -55°C ~ 155°C; RoHS: RoHS Compliant; Size / Dimension: 0.039" L x 0.020" W (1.00mm x 0.50mm); Composition: Thin Film; Package / Case: 0402 (1005 Metric); Height: 0.016" (0.40mm); Features: Automotive AEC-Q200; Supplier Device Package: 0402; Category: Resistors
R131 R132 = Res_0402: Manufacturer: Yageo; Manufacturer Part Number 1: RC0402FR-0710KL; Part Description: RES SMD 10K OHM 1% 1/16W 0402; Temperature Coefficient: ±100ppm/°C; Power (Watts): 0.063W, 1/16W; Value: 10k, 1%; Supplier 1: Digi-Key; Supplier Part Number 1: 311-10.0KLRTR-ND; Resistance (Ohms): 10k; Packaging: Tape & Reel (TR); RoHS: RoHS Compliant; Package / Case: 0402 (1005 Metric); Tolerance: ±1%; Operating Temperature: -55°C ~ 155°C; Size / Dimension: 0.039" L x 0.020" W (1.00mm x 0.50mm); Number of Terminations: 2; Category: Resistors; Height: 0.016" (0.40mm); Supplier Device Package: 0402; Features: Moisture Resistant; Composition: Thick Film
R134 = Res_0402: Manufacturer: Yageo; Manufacturer Part Number 1: RC0402JR-07330RL; Part Description: RES SMD 330 OHM 5% 1/16W 0402; Power (Watts): 0.063W, 1/16W; Resistance (Ohms): 330; Temperature Coefficient: ±100ppm/°C; Value: 330R, 5%; Supplier 1: Digi-Key; Supplier Part Number 1: 311-330JRTR-ND; Composition: Thick Film; Supplier Device Package: 0402; Package / Case: 0402 (1005 Metric); Size / Dimension: 0.039" L x 0.020" W (1.00mm x 0.50mm); Features: Moisture Resistant; Height: 0.016" (0.40mm); Packaging: Tape & Reel (TR); RoHS: RoHS Compliant; Tolerance: ±5%; Category: Resistors; Number of Terminations: 2; Operating Temperature: -55°C ~ 155°C
XO1 = RPT7050A: Manufacturer Part Number 1: E6245LF; Part Description: TCXO 30.72MHz, E6245LF; Manufacturer: Rakon; Supplier 1: Rakon; Supplier Part Number 1: E6245LF
XO2 = TXCO: Manufacturer Part Number 1: E5280LF; Part Description: TCXO 30.72MHz, E5280LF; Manufacturer: Rakon; Supplier 1: Rakon; Supplier Part Number 1: E5280LF
XO3 = Rakon_RTX5032A: Part Description: RTX5032A 40MHz, High performance TCXO, With VC, Filter Enabled, 10-pin 5mm x 3.2 mm x 1.65 mm package; Manufacturer: Rakon; Manufacturer Part Number 1: RTX5032A; Supplier Part Number 1: RTX5032A; Supplier 1: RAKON
XT1 = CRYSTAL_19M2: Oscillator Crystal 25 MHz; Manufacturer Part Number 1: ABM8-25.000MHZ-B2-T; Manufacturer: ABRACON; Part Description: 25MHz ±20ppm Crystal 18pF 50 Ohm -20°C ~ 70°C Surface Mount 4-SMD, No Lead (DFN, LCC); Supplier 1: Newark; Supplier Part Number 1: 13J1767

## Sheet 15_Clocks_2.SchDoc: Clocks 2
size A4; Organization: Lime Microsystems; Address1: Surrey Tech Centre; Address2: Guildford GU2 7YG; Address3: Surrey; Address4: United Kingdom; Revision: v1.3; SheetNumber: 15; SheetTotal: 16
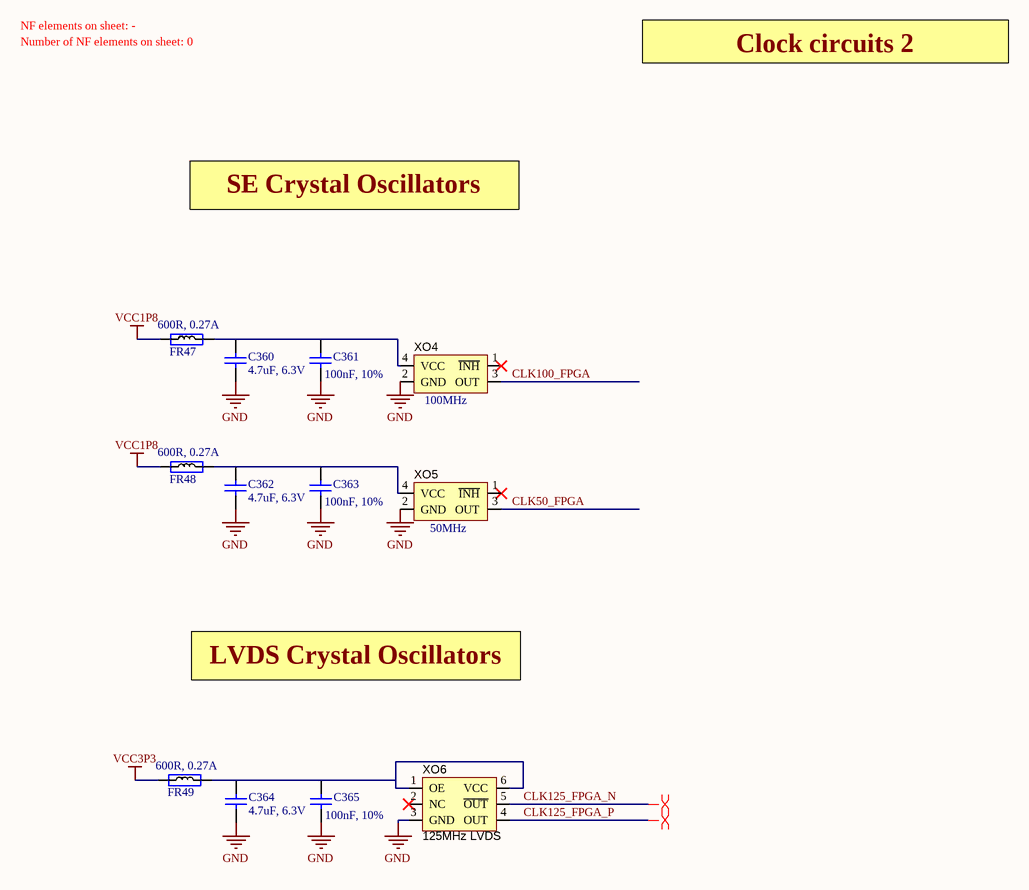
[diagram p15: 15_Clocks_2.SchDoc]

### Parts
C360  4.7uF, 6.3V  [CAP0402]
C361  100nF, 10%  [CAP0402]
C362  4.7uF, 6.3V  [CAP0402]
C363  100nF, 10%  [CAP0402]
C364  4.7uF, 6.3V  [CAP0402]
C365  100nF, 10%  [CAP0402]
FR47  600R, 0.27A  [RES0201]
FR48  600R, 0.27A  [RES0201]
FR49  600R, 0.27A  [RES0201]
XO4  value 100MHz  [CRYSTAL_4-LCC_v4]  (hidden comment: CRYSTAL 100MHz)
XO5  value 50MHz  [CRYSTAL_4-LCC_v4]  (hidden comment: CRYSTAL 50MHz (nr. 1))
XO6  125MHz LVDS  [CRYSTAL_6-LCC]

### Nets
GND: C360.1 C361.2 C362.1 C363.2 C364.1 C365.2 XO4.2(GND) XO5.2(GND) XO6.3(GND)
VCC1P8: FR47.1 FR48.1
VCC3P3: FR49.1
CLK50_FPGA: XO5.3(OUT)
CLK100_FPGA: XO4.3(OUT)
CLK125_FPGA_N: XO6.5(~{OUT})
CLK125_FPGA_P: XO6.4(OUT)
NetC360_2: C360.2 C361.1 FR47.2 XO4.4(VCC)
NetC362_2: C362.2 C363.1 FR48.2 XO5.4(VCC)
NetC364_2: C364.2 C365.1 FR49.2 XO6.1(OE) XO6.6(VCC)

Not connected (* = marked no-connect by the designer): XO4 1(~{INH})*; XO5 1(~{INH})*; XO6 2(NC)*

### Layout directives
differential pair: CLK125_FPGA_N, CLK125_FPGA_P

### Notes on the sheet
- Number of NF elements on sheet: 0
- NF elements on sheet: -
- Clock circuits 2
- SE Crystal Oscillators
- LVDS Crystal Oscillators
- Project name:
- Title:
- Size:
- Date:
- A4
- Revision:
- Time:
- Sheet
- of
- File:

### Library data of the parts
C360 C362 C364 = Cap_0402: as C319 on sheet 14_Clocks_1; Value: 4.7uF, 6.3V; Supplier 1: Digi-Key; Supplier Part Number 1: 490-5408-1-ND; Category: Capacitors; Voltage - Rated: 6.3V; Thickness (Max): 0.022" (0.55mm); Applications: General Purpose; Package / Case: 0402 (1005 Metric); Size / Dimension: 0.039" L x 0.020" W (1.00mm x 0.50mm); Features: Derating Recommended; Mounting Type: Surface Mount, MLCC; Ratings: -; Lead Style: -; Operating Temperature: -55°C ~ 85°C; Lead Spacing: -; RoHS: RoHS Compliant; Height - Seated (Max): -; Packaging: Cut Tape (CT)
C361 C363 C365 = Cap_0603: as C335 on sheet 14_Clocks_1; Supplier 1: Mouser; Supplier Part Number 1: 81-GRM155R71C104KA88; Tolerance: 10 %; Case Code - in: 0402; Manufacturer: Murata Electronics; Category: Multilayer Ceramic Capacitors MLCC - SMD/SMT; Value: 100nF, 10%; Manufacturer Part Number: GRM155R71C104KA88D; Maximum Operating Temperature: + 125 C; Minimum Operating Temperature: - 55 C; Minimum Order Quantity: 1; Operating Temperature Range: - 55 C to + 125 C; Package / Case: 0402 (1005 metric); Packaging: Reel; Product: General Type MLCCs; Product Category: Low & Medium Capacitance SMD Ceramic Chip Capacitors; Reeling: True; RoHS - Mouser: Y; RoHS: RoHS Compliant; Series: GRM; Standard Pack Qty: 10000; Termination Style: SMD/SMT
FR47-FR49 = Ferrite: Manufacturer Part Number 1: BK0603TS601-T; Manufacturer: Taiyo Yuden; Part Description: FERRITE BEAD 600 OHM 0201 1LN; DC Resistance (DCR): 750 mOhm Max; Filter Type: Differential Mode - Single; Impedance @ Frequency: 600 Ohm @ 100MHz; Current Rating: 270mA; Supplier 1: Digi-Key; Supplier Part Number 1: 587-3277-1-ND; Size / Dimension: 0.024" L x 0.012" W (0.60mm x 0.30mm); Package / Case: 0201 (0603 Metric); Height (Max): 0.013" (0.33mm); Mounting Type: Surface Mount; Packaging: Cut Tape (CT); RoHS: RoHS Compliant; Category: Filters; Value: 600R, 0.27A
XO4 = CRYSTAL: Oscillator Crystal; Manufacturer Part Number: KC5032A100.000C1GE00; Manufacturer: AVX Corp/Kyocera Corp; Part Description: OSC XO 100.000MHZ CMOS SMD; Current - Supply (Max): 19mA; Current - Supply (Disable) (Max): 10µA; Voltage - Supply: 1.8V, 2.5V, 3.3V; Function: Standby (Power Down); Output: CMOS; Frequency Stability: ±50ppm; Package / Case: 4-SMD, No Lead (DFN, LCC); Mounting Type: Surface Mount; Ratings: -; RoHS: RoHS Compliant; Height: 0.039" (1.00mm); Category: Crystals and Oscillators; Supplier Part Number 1: 1253-1302-1-ND; Supplier 1: Digi-Key; Size / Dimension: 0.197" L x 0.126" W (5.00mm x 3.20mm); Packaging: Cut Tape (CT); Frequency: 100MHz; Operating Temperature: -40°C ~ 85°C; Type: XO (Standard)
XO5 = CRYSTAL: Oscillator Crystal; Manufacturer Part Number: KC5032A50.0000CMGE00; Manufacturer: AVX Corp/Kyocera Corp; Part Description: OSCILLATOR XO 50.000MHZ CMOS SMD; Current - Supply (Disable) (Max): 10µA; Frequency Stability: ±50ppm; Voltage - Supply: 1.8V, 2.5V, 3.3V, 5V; Output: CMOS; Current - Supply (Max): 9.5mA; Function: Standby (Power Down); Package / Case: 4-SMD, No Lead (DFN, LCC); Height: 0.039" (1.00mm); Supplier Part Number 1: 1253-1297-1-ND; Supplier 1: Digi-Key; Packaging: Cut Tape (CT); Category: Crystals and Oscillators; Mounting Type: Surface Mount; RoHS: RoHS Compliant; Frequency: 50MHz; Ratings: -; Type: XO (Standard); Size / Dimension: 0.197" L x 0.126" W (5.00mm x 3.20mm); Operating Temperature: -40°C ~ 85°C
XO6 = CRYSTAL_SG3225: Oscillator Crystal; Manufacturer: EPSON; Manufacturer Part Number 1: SG3225VAN 125.000000M-KEGA3; Part Description: 125MHz LVDS XO (Standard) Oscillator Surface Mount 2.5 V ~ 3.3 V 30mA Enable/Disable; Function: Tri-State (Output Enable); Current - Supply (Max): 30mA; Current - Supply (Disable) (Max): 20mA; Frequency Stability: ±30ppm; Voltage - Supply: 2.5 V ~ 3.3 V; Supplier 1: Digi-Key; Supplier Part Number 1: SER3930CT-ND; Operating Temperature: -40°C ~ 85°C; Packaging: Cut Tape (CT); Mounting Type: Surface Mount; Type: XO (Standard); RoHS: RoHS Compliant; Height: 0.047" (1.20mm); Category: Crystals and Oscillators; Ratings: -; Package / Case: 6-SMD, No Lead (DFN, LCC); Output: LVDS; Size / Dimension: 0.126" L x 0.098" W (3.20mm x 2.50mm); Frequency: 125MHz; Value: 125MHz LVDS